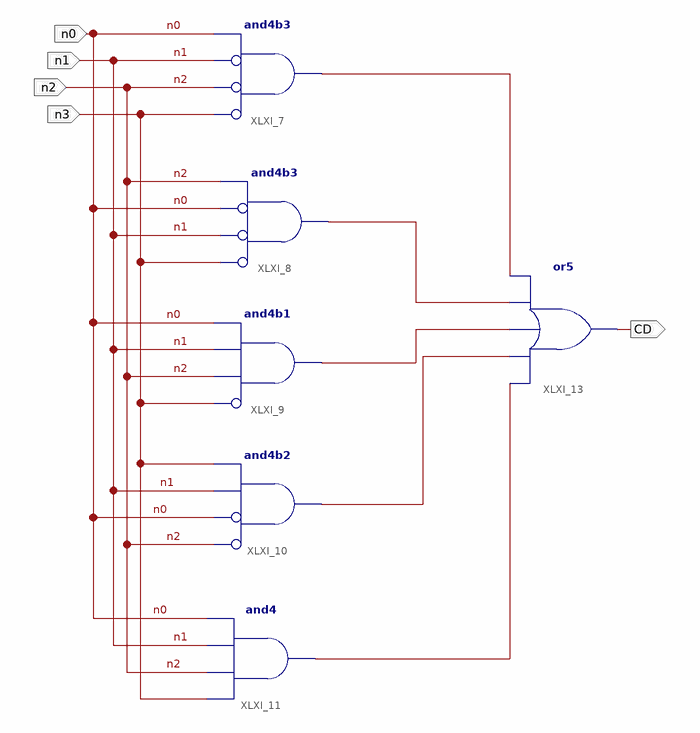
[diagram p0: schematic sheet 1]
// Xilinx ISE schematic D.sch (spartan3e) as structural Verilog: 6 symbols, 5 ports
module D (
  input  n0,
  input  n1,
  input  n2,
  input  n3,
  output CD
);

  wire XLXN_1, XLXN_2, XLXN_3, XLXN_4, XLXN_5;

  and XLXI_7 (XLXN_1, ~n3, ~n2, ~n1, n0);  // and4b3
  and XLXI_8 (XLXN_2, ~n3, ~n1, ~n0, n2);  // and4b3
  and XLXI_9 (XLXN_3, ~n3, n2, n1, n0);  // and4b1
  and XLXI_10 (XLXN_4, ~n2, ~n0, n1, n3);  // and4b2
  and XLXI_11 (XLXN_5, n3, n2, n1, n0);
  or XLXI_13 (CD, XLXN_5, XLXN_4, XLXN_3, XLXN_2, XLXN_1);
endmodule
